# Altium schematic sheet GMR.SchDoc: Geiger-Müller counter
size A4; Author: Tong; Revision: 1.0
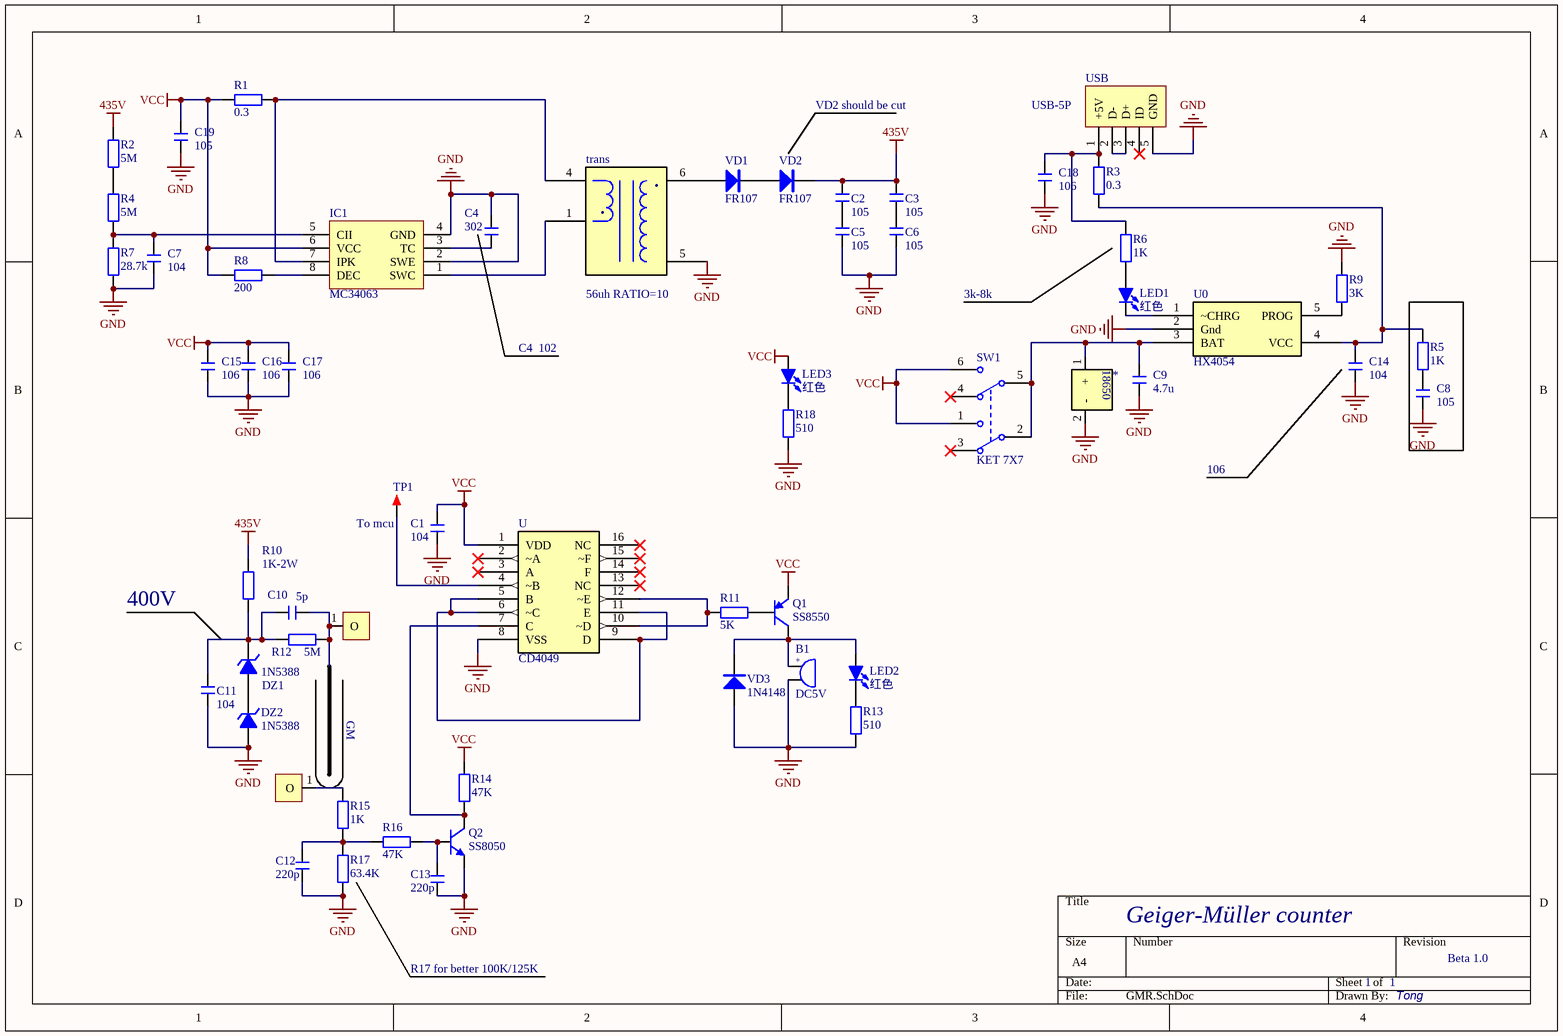
[diagram p0: GMR.SchDoc]

## Parts
*  Component_1  [18650base]  (value not drawn)
B1  DC5V  [BEEP 7.6X12X7.5]
C1  104  [C 0603]
C2  105  [C 1812]
C3  105  [C 1812]
C4  302  [C 0603]
C5  105  [C 1812]
C6  105  [C 1812]
C7  104  [C 0603]
C8  105  [C 0603]
C9  4.7u  [C 0603]
C10  5p  [C 1206]
C11  104  [C 1812]
C12  220p  [C 0603]
C13  220p  [C 0603]
C14  104  [C 0603]
C15  106  [C 0603]
C16  106  [C 0603]
C17  106  [C 0603]
C18  106  [C 0603]
C19  105  [C 0603]
DZ1  1N5388  [wydiode]
DZ2  1N5388  [wydiode]
IC1  MC34063  [SOP8_L]
LED1  红色  [LED 0603B]
LED2  红色  [LED]
LED3  红色  [LED]
Q1  SS8550  [SOT23-3N]
Q2  SS8050  [SOT23-3L]
R1  0.3  [Res-SMD-1206]
R2  5M  [Res-SMD-1206]
R3  0.3  [Res-SMD-1206]
R4  5M  [Res-SMD-1206]
R5  1K  [Res-SMD-0603]
R6  1K  [Res-SMD-0603]
R7  28.7k  [Res-SMD-0603]
R8  200  [Res-SMD-0603]
R9  3K  [Res-SMD-0603]
R10  1K-2W  [Res-Axial-2W]
R11  5K  [Res-SMD-0603]
R12  5M  [Res-Axial-1/4W]
R13  510  [Res-SMD-0603]
R14  47K  [Res-SMD-0603]
R15  1K  [Res-SMD-0603]
R16  47K  [Res-SMD-0603]
R17  63.4K  [Res-SMD-0603]
R18  510  [Res-SMD-0603]
SW1  KET 7X7  [5.8*5.8]
TP1  To mcu  [TEST TP1.4_B]
trans  (no value)  [trans]
tube1  tube1  [PCBComponent_1]  (value not drawn)
tube2  tube2  [PCBComponent_1]  (value not drawn)
U  CD4049  [SOP16_L]
U0  HX4054  [SOT23-5L]
USB  USB-5P  [USB-MICRO_B]
VD1  FR107  [SOD-123F]
VD2  FR107  [SOD-123F]
VD3  1N4148  [SOD-123F]

## Nets
435V: C2.1 C3.1 R2.2 R10.2 VD2.2(K)
GND: *.2(-) B1.2 C1.2 C4.1 C5.2 C6.2 C7.2 C8.2 C9.2 C11.2 C12.2 C13.2 C14.2 C15.2 C16.2 C17.2 C18.2 C19.2 DZ2.1(A) IC1.2(SWE) IC1.4(GND) Q2.2(E) R7.1 R9.1 R13.1 R17.1 R18.1 trans.5 U.8(VSS) U0.2(Gnd) USB.5(GND) VD3.1(A)
VCC: C1.1 C15.1 C16.1 C17.1 C19.1 IC1.6(VCC) LED3.1(A) Q1.2(E) R1.2 R8.2 R14.1 SW1.1(NC1) SW1.6(NC2) U.1(VDD)
Net*_1: *.1(+) C9.1 SW1.2(COM2) SW1.5(COM2) U0.3(BAT)
NetB1_1: B1.1 LED2.1(A) Q1.3(C) VD3.2(K)
NetC2_2: C2.2 C5.1
NetC3_2: C3.2 C6.1
NetC4_2: C4.2 IC1.3(TC)
NetC7_1: C7.1 IC1.5(CII) R4.1 R7.2
NetC10_1: C10.1 R12.2 tube2.1(O)
NetC10_2: C10.2 C11.1 DZ1.2(K) R10.1 R12.1
NetC12_1: C12.1 R15.1 R16.2 R17.2
NetC13_1: C13.1 Q2.1(B) R16.1
NetC14_1: C14.1 R3.2 R5.1 U0.4(VCC)
NetC18_1: C18.1 R3.1 R6.1 USB.1(+5V)
NetDZ1_1: DZ1.1(A) DZ2.2(K)
NetIC1_1: IC1.1(SWC) trans.1
NetIC1_7: IC1.7(IPK) R1.1 trans.4
NetIC1_8: IC1.8(DEC) R8.1
NetLED1_1: LED1.1(A) R6.2
NetLED1_2: LED1.2(K) U0.1(~CHRG)
NetLED2_2: LED2.2(K) R13.2
NetLED3_2: LED3.2(K) R18.2
NetQ1_1: Q1.1(B) R11.2
NetQ2_3: Q2.3(C) R14.2 U.7(C)
NetR2_1: R2.1 R4.2
NetR9_2: R9.2 U0.5(PROG)
NetR11_1: R11.1 U.10(~D) U.12(~E)
NetR15_2: R15.2 tube1.1(O)
NetTP1_1: TP1.1 U.4(~B)
Nettrans_6: trans.6 VD1.1(A)
NetU_5: U.5(B) U.6(~C) U.9(D) U.11(E)
NetUSB_2: USB.2(D-) USB.3(D+)
NetVD1_2: VD1.2(K) VD2.1(A)

Not connected (* = marked no-connect by the designer): C8 1; R5 2; SW1 3(NO1)* 4(NO2)*; U 2(~A)* 3(A)* 13(NC)* 14(F)* 15(~F)* 16(NC)*; USB 4(ID)*

## Notes on the sheet
- VD2 should be cut
- 3k-8k
- C4  102
- 106
- 400V
- GM
- Geiger-Müller counter
- R17 for better 100K/125K
- 1
- Beta 1.0
- Tong
- Title
- Size:
- Date:
- A4
- Number:
- Time:
- Revision:
- Sheet
- of
- File:
- (in symbol BEEP) +
- (in symbol Component_1) .; 56uh RATIO=10; 18650

## Library data of the parts
B1 = BEEP: 蜂鸣器; 版权归属: 源创客; BOM名称: 蜂鸣器; 学习资源: www.ooocke.com
C1-C19 = Cap-CER-SMD: 瓷片电容-贴片
DZ1 DZ2 = 1N5256: 30V/0.5W稳压管; 版权归属: 源创客; BOM名称: 30V/0.5W稳压管; 学习资源: www.ooocke.com
IC1 = MC34063: DC升降压芯片; 版权归属: 源创客; BOM名称: DC升降压芯片; 学习资源: www.ooocke.com
LED1-LED3 = LED-SMD: 贴片LED
Q1 = 8550-SMD: 高频放大-PNP型; 版权归属: 源创客; 属性: 40V 1.5A 1W 100MHZ; BOM名称: 高频放大-PNP型; 学习资源: www.ooocke.com
Q2 = 8050-SMD: 高频放大-NPN型; 版权归属: 源创客; 属性: 40V 1.5A 1W 100MHZ; BOM名称: 高频放大-NPN型; 学习资源: www.ooocke.com
R1-R9 R11 R13-R18 = Res-Fixed-SMD: 固定电阻器-贴片
R10 R12 = Res-Fixed-Axial: 固定电阻器-直插
SW1 = KET 7X7: 7*7自锁开关; 版权归属: 源创客; BOM名称: 7*7自锁开关; 学习资源: www.ooocke.com
TP1 = TEST TP: 测试环; 版权归属: 源创客; BOM名称: 测试环; 学习资源: www.ooocke.com
trans tube1 tube2 U U0 = Component_1
USB = USB-5P: 微型USB母座; 版权归属: 源创客; BOM名称: 微型USB母座; 学习资源: www.ooocke.com
VD1 VD2 = FR107: 快恢复整流二极管; BOM名称: 快恢复二极管; 版权归属: 源创客; 属性: 700V/1A; 学习资源: www.ooocke.com
VD3 = 1N4148: 高速开关二极管; 版权归属: 源创客; BOM名称: 高速开关二极管; 学习资源: www.ooocke.com